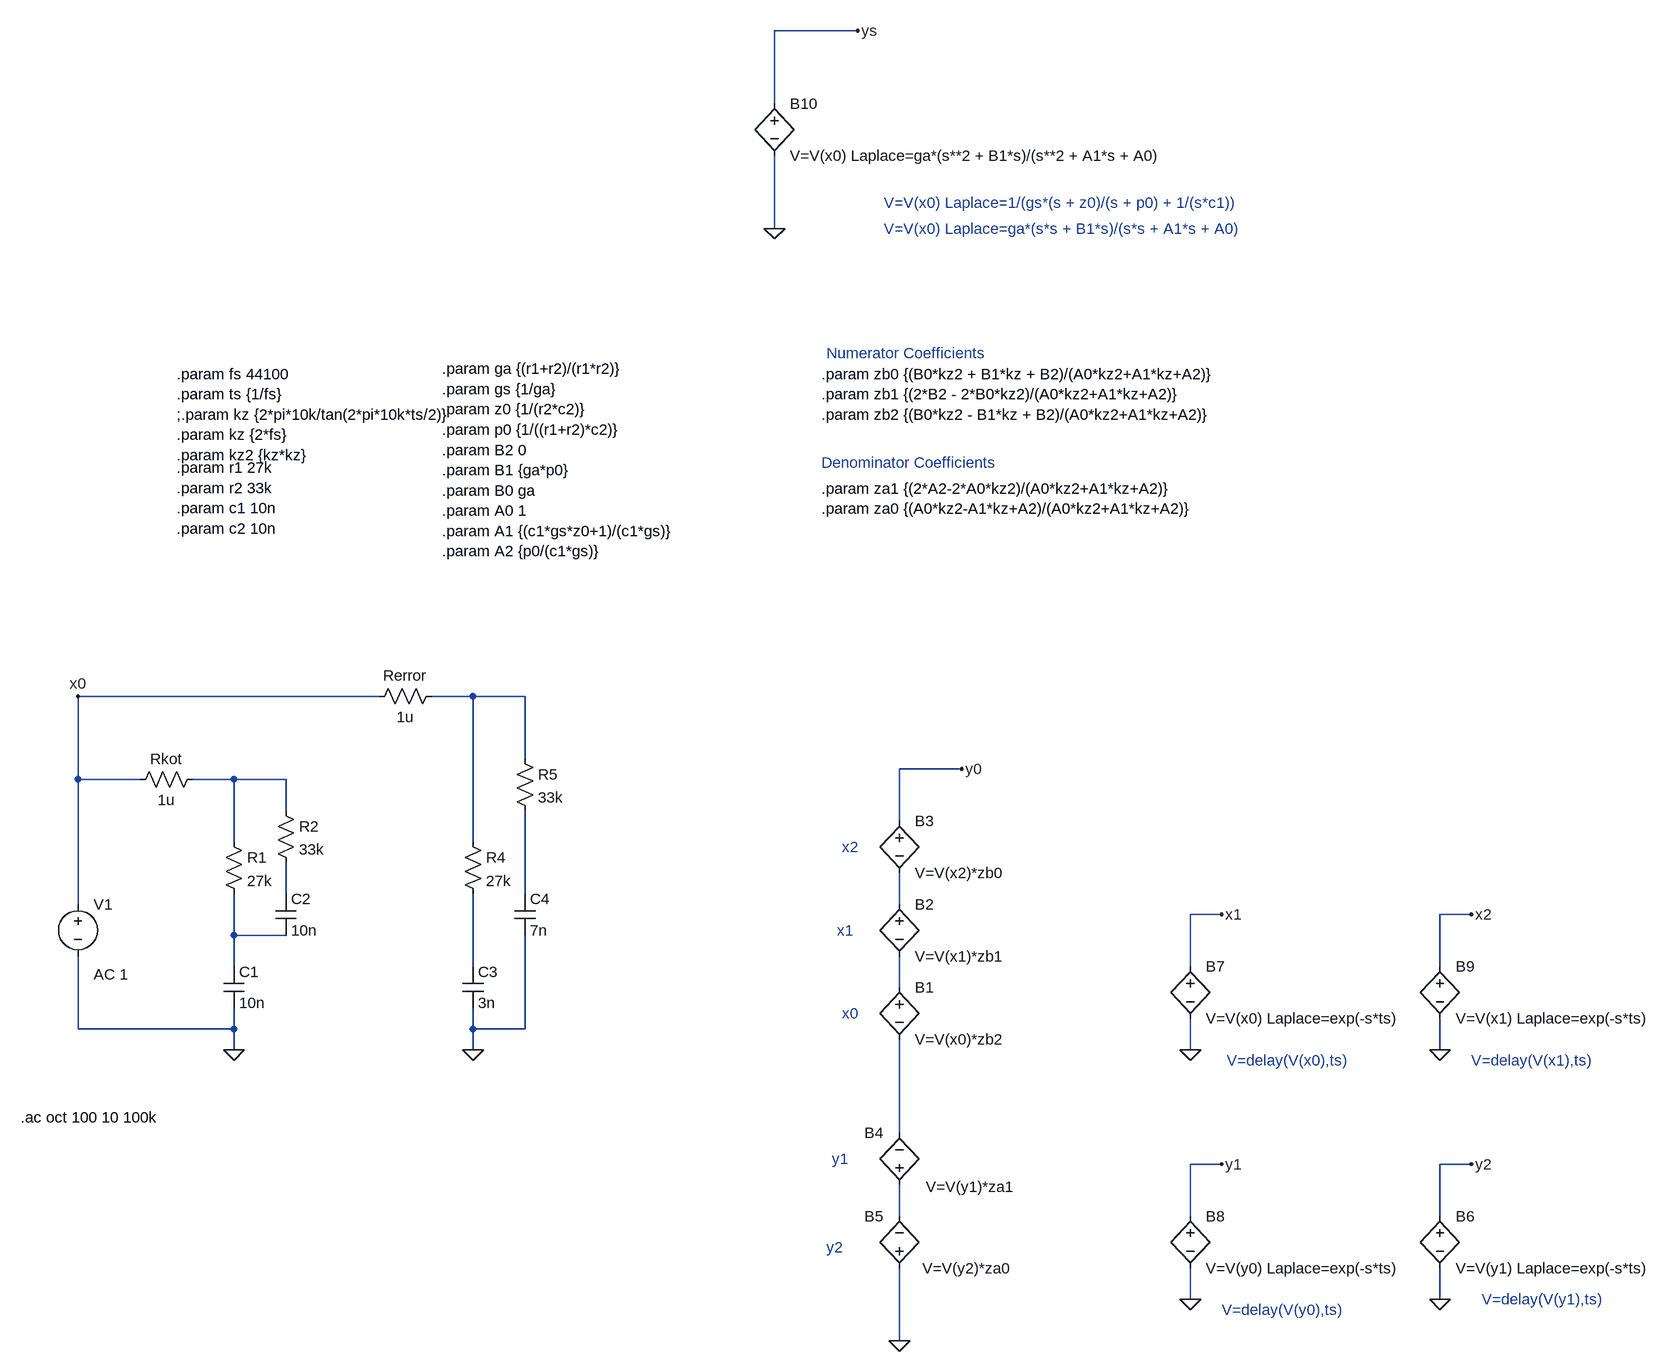
[diagram p0: schematic kot_pre1.asc]
kot_pre1.asc, the LTspice schematic file:
Version 4
SHEET 1 2252 868
WIRE 1024 -1248 896 -1248
WIRE 896 -1136 896 -1248
WIRE 896 -944 896 -1056
WIRE 288 -224 -176 -224
WIRE 432 -224 368 -224
WIRE 512 -224 432 -224
WIRE 512 -128 512 -224
WIRE 1184 -112 1088 -112
WIRE -176 -96 -176 -224
WIRE -80 -96 -176 -96
WIRE 64 -96 0 -96
WIRE 144 -96 64 -96
WIRE 144 -48 144 -96
WIRE 1088 -32 1088 -112
WIRE 64 0 64 -96
WIRE 432 0 432 -224
WIRE 144 80 144 32
WIRE 512 80 512 -48
WIRE -176 96 -176 -96
WIRE 1088 96 1088 48
WIRE 1584 112 1536 112
WIRE 1968 112 1920 112
WIRE 64 144 64 80
WIRE 144 144 64 144
WIRE 64 192 64 144
WIRE 432 192 432 80
WIRE 1536 192 1536 112
WIRE 1920 192 1920 112
WIRE 1088 224 1088 176
WIRE -176 288 -176 176
WIRE 64 288 64 256
WIRE 64 288 -176 288
WIRE 432 288 432 256
WIRE 512 288 512 144
WIRE 512 288 432 288
WIRE 64 320 64 288
WIRE 432 320 432 288
WIRE 1536 320 1536 272
WIRE 1920 320 1920 272
WIRE 1088 448 1088 304
WIRE 1584 496 1536 496
WIRE 1968 496 1920 496
WIRE 1088 576 1088 528
WIRE 1536 576 1536 496
WIRE 1920 576 1920 496
WIRE 1536 704 1536 656
WIRE 1920 704 1920 656
WIRE 1088 768 1088 656
FLAG 64 320 0
FLAG 432 320 0
FLAG 1184 -112 y0
FLAG 1536 704 0
FLAG 1584 496 y1
FLAG 1920 704 0
FLAG 1968 496 y2
FLAG 1536 320 0
FLAG 1584 112 x1
FLAG 1920 320 0
FLAG 1968 112 x2
FLAG -176 -224 x0
FLAG 1088 768 0
FLAG 896 -944 0
FLAG 1024 -1248 ys
SYMBOL cap 48 192 R0
SYMATTR InstName C1
SYMATTR Value 10n
SYMBOL cap 128 80 R0
SYMATTR InstName C2
SYMATTR Value 10n
SYMBOL res 48 -16 R0
SYMATTR InstName R1
SYMATTR Value 27k
SYMBOL res 128 -64 R0
SYMATTR InstName R2
SYMATTR Value 33k
SYMBOL voltage -176 80 R0
WINDOW 123 24 124 Left 2
WINDOW 39 0 0 Left 2
SYMATTR InstName V1
SYMATTR Value ""
SYMATTR Value2 AC 1
SYMBOL res -96 -80 R270
WINDOW 0 32 56 VTop 2
WINDOW 3 0 56 VBottom 2
SYMATTR InstName Rkot
SYMATTR Value 1u
SYMBOL cap 416 192 R0
SYMATTR InstName C3
SYMATTR Value 3n
SYMBOL cap 496 80 R0
SYMATTR InstName C4
SYMATTR Value 7n
SYMBOL res 416 -16 R0
SYMATTR InstName R4
SYMATTR Value 27k
SYMBOL res 496 -144 R0
SYMATTR InstName R5
SYMATTR Value 33k
SYMBOL res 272 -208 R270
WINDOW 0 32 56 VTop 2
WINDOW 3 0 56 VBottom 2
SYMATTR InstName Rerror
SYMATTR Value 1u
SYMBOL bv 1088 208 R0
SYMATTR InstName B1
SYMATTR Value V=V(x0)*zb2
SYMBOL bv 1088 80 R0
SYMATTR InstName B2
SYMATTR Value V=V(x1)*zb1
SYMBOL bv 1088 -48 R0
SYMATTR InstName B3
SYMATTR Value V=V(x2)*zb0
SYMBOL bv 1088 544 R180
WINDOW 0 24 96 Left 2
WINDOW 3 -177 13 Left 2
SYMATTR InstName B4
SYMATTR Value V=V(y1)*za1
SYMBOL bv 1088 672 R180
WINDOW 0 24 96 Left 2
WINDOW 3 -171 16 Left 2
SYMATTR InstName B5
SYMATTR Value V=V(y2)*za0
SYMBOL bv 1536 560 R0
SYMATTR InstName B8
SYMATTR Value V=V(y0) Laplace=exp(-s*ts)
SYMBOL bv 1920 560 R0
SYMATTR InstName B6
SYMATTR Value V=V(y1) Laplace=exp(-s*ts)
SYMBOL bv 1536 176 R0
SYMATTR InstName B7
SYMATTR Value V=V(x0) Laplace=exp(-s*ts)
SYMBOL bv 1920 176 R0
SYMATTR InstName B9
SYMATTR Value V=V(x1) Laplace=exp(-s*ts)
SYMBOL bv 896 -1152 R0
SYMATTR InstName B10
SYMATTR Value V=V(x0) Laplace=ga*(s**2 + B1*s)/(s**2 + A1*s + A0)
TEXT -264 424 Left 2 !.ac oct 100 10 100k
TEXT -24 -720 Left 2 !.param fs 44100\n.param ts {1/fs}\n;.param kz {2*pi*10k/tan(2*pi*10k*ts/2)}\n.param kz {2*fs}\n.param kz2 {kz*kz}
TEXT -24 -576 Left 2 !.param r1 27k\n.param r2 33k\n.param c1 10n\n.param c2 10n
TEXT 384 -728 Left 2 !.param ga {(r1+r2)/(r1*r2)}\n.param gs {1/ga}\n.param z0 {1/(r2*c2)}\n.param p0 {1/((r1+r2)*c2)}\n.param B2 0\n.param B1 {ga*p0}\n.param B0 ga\n.param A0 1\n.param A1 {(c1*gs*z0+1)/(c1*gs)}\n.param A2 {p0/(c1*gs)}
TEXT 968 -720 Left 2 !.param zb0 {(B0*kz2 + B1*kz + B2)/(A0*kz2+A1*kz+A2)}\n.param zb1 {(2*B2 - 2*B0*kz2)/(A0*kz2+A1*kz+A2)}\n.param zb2 {(B0*kz2 - B1*kz + B2)/(A0*kz2+A1*kz+A2)}
TEXT 976 -752 Left 2 ;Numerator Coefficients
TEXT 968 -584 Left 2 ;Denominator Coefficients
TEXT 968 -544 Left 2 !.param za1 {(2*A2-2*A0*kz2)/(A0*kz2+A1*kz+A2)}\n.param za0 {(A0*kz2-A1*kz+A2)/(A0*kz2+A1*kz+A2)}
TEXT 976 624 Left 2 ;y2
TEXT 984 488 Left 2 ;y1
TEXT 1000 264 Left 2 ;x0
TEXT 992 136 Left 2 ;x1
TEXT 1000 8 Left 2 ;x2
TEXT 1064 -944 Left 2 ;V=V(x0) Laplace=ga*(s*s + B1*s)/(s*s + A1*s + A0)
TEXT 1064 -984 Left 2 ;V=V(x0) Laplace=1/(gs*(s + z0)/(s + p0) + 1/(s*c1))
TEXT 1592 336 Left 2 ;V=delay(V(x0),ts)
TEXT 1968 336 Left 2 ;V=delay(V(x1),ts)
TEXT 1584 720 Left 2 ;V=delay(V(y0),ts)
TEXT 1984 704 Left 2 ;V=delay(V(y1),ts)

The netlist it stands for:
* kot_pre1.asc
C1 N006 0 10n
C2 N003 N006 10n
R1 N002 N006 27k
R2 N002 N003 33k
V1 x0 0 AC 1
Rkot x0 N002 1u
C3 N007 0 3n
C4 N004 0 7n
R4 N001 N007 27k
R5 N001 N004 33k
Rerror x0 N001 1u
B1 N008 N009 V=V(x0)*zb2
B2 N005 N008 V=V(x1)*zb1
B3 y0 N005 V=V(x2)*zb0
B4 N010 N009 V=V(y1)*za1
B5 0 N010 V=V(y2)*za0
B8 y1 0 V=V(y0) Laplace=exp(-s*ts)
B6 y2 0 V=V(y1) Laplace=exp(-s*ts)
B7 x1 0 V=V(x0) Laplace=exp(-s*ts)
B9 x2 0 V=V(x1) Laplace=exp(-s*ts)
B10 ys 0 V=V(x0) Laplace=ga*(s**2 + B1*s)/(s**2 + A1*s + A0)
.ac oct 100 10 100k
.param fs 44100
.param ts {1/fs}
;.param kz {2*pi*10k/tan(2*pi*10k*ts/2)}
.param kz {2*fs}
.param kz2 {kz*kz}
.param r1 27k
.param r2 33k
.param c1 10n
.param c2 10n
.param ga {(r1+r2)/(r1*r2)}
.param gs {1/ga}
.param z0 {1/(r2*c2)}
.param p0 {1/((r1+r2)*c2)}
.param B2 0
.param B1 {ga*p0}
.param B0 ga
.param A0 1
.param A1 {(c1*gs*z0+1)/(c1*gs)}
.param A2 {p0/(c1*gs)}
.param zb0 {(B0*kz2 + B1*kz + B2)/(A0*kz2+A1*kz+A2)}
.param zb1 {(2*B2 - 2*B0*kz2)/(A0*kz2+A1*kz+A2)}
.param zb2 {(B0*kz2 - B1*kz + B2)/(A0*kz2+A1*kz+A2)}
* Numerator Coefficients
* Denominator Coefficients
.param za1 {(2*A2-2*A0*kz2)/(A0*kz2+A1*kz+A2)}
.param za0 {(A0*kz2-A1*kz+A2)/(A0*kz2+A1*kz+A2)}
* y2
* y1
* x0
* x1
* x2
* V=V(x0) Laplace=ga*(s*s + B1*s)/(s*s + A1*s + A0)
* V=V(x0) Laplace=1/(gs*(s + z0)/(s + p0) + 1/(s*c1))
* V=delay(V(x0),ts)
* V=delay(V(x1),ts)
* V=delay(V(y0),ts)
* V=delay(V(y1),ts)
.backanno
.end